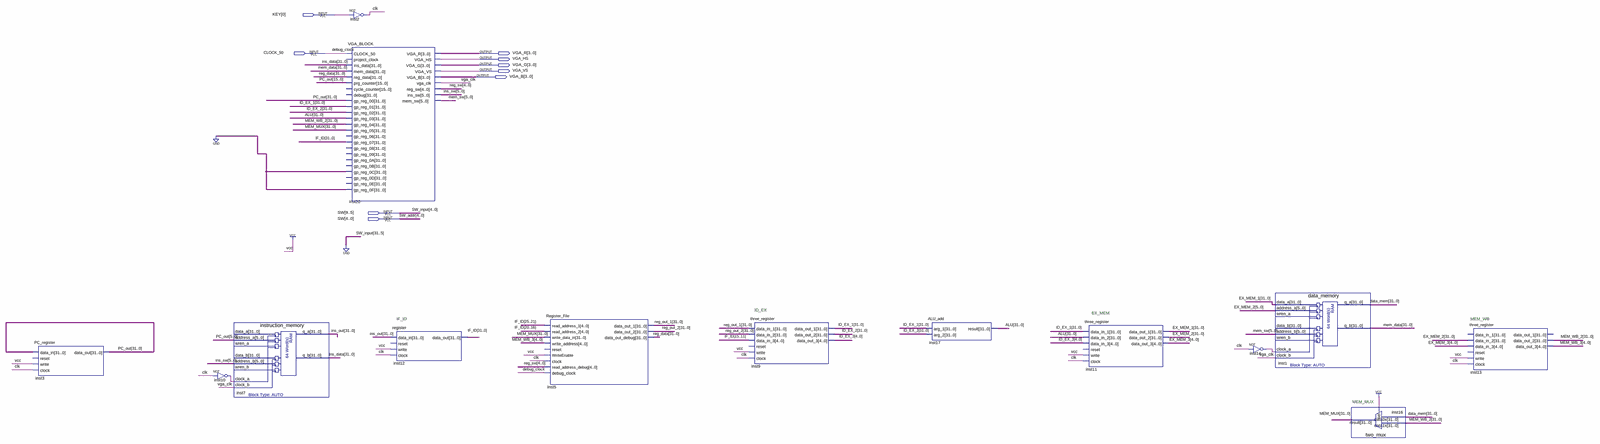
[diagram p0: schematic sheet, whole]
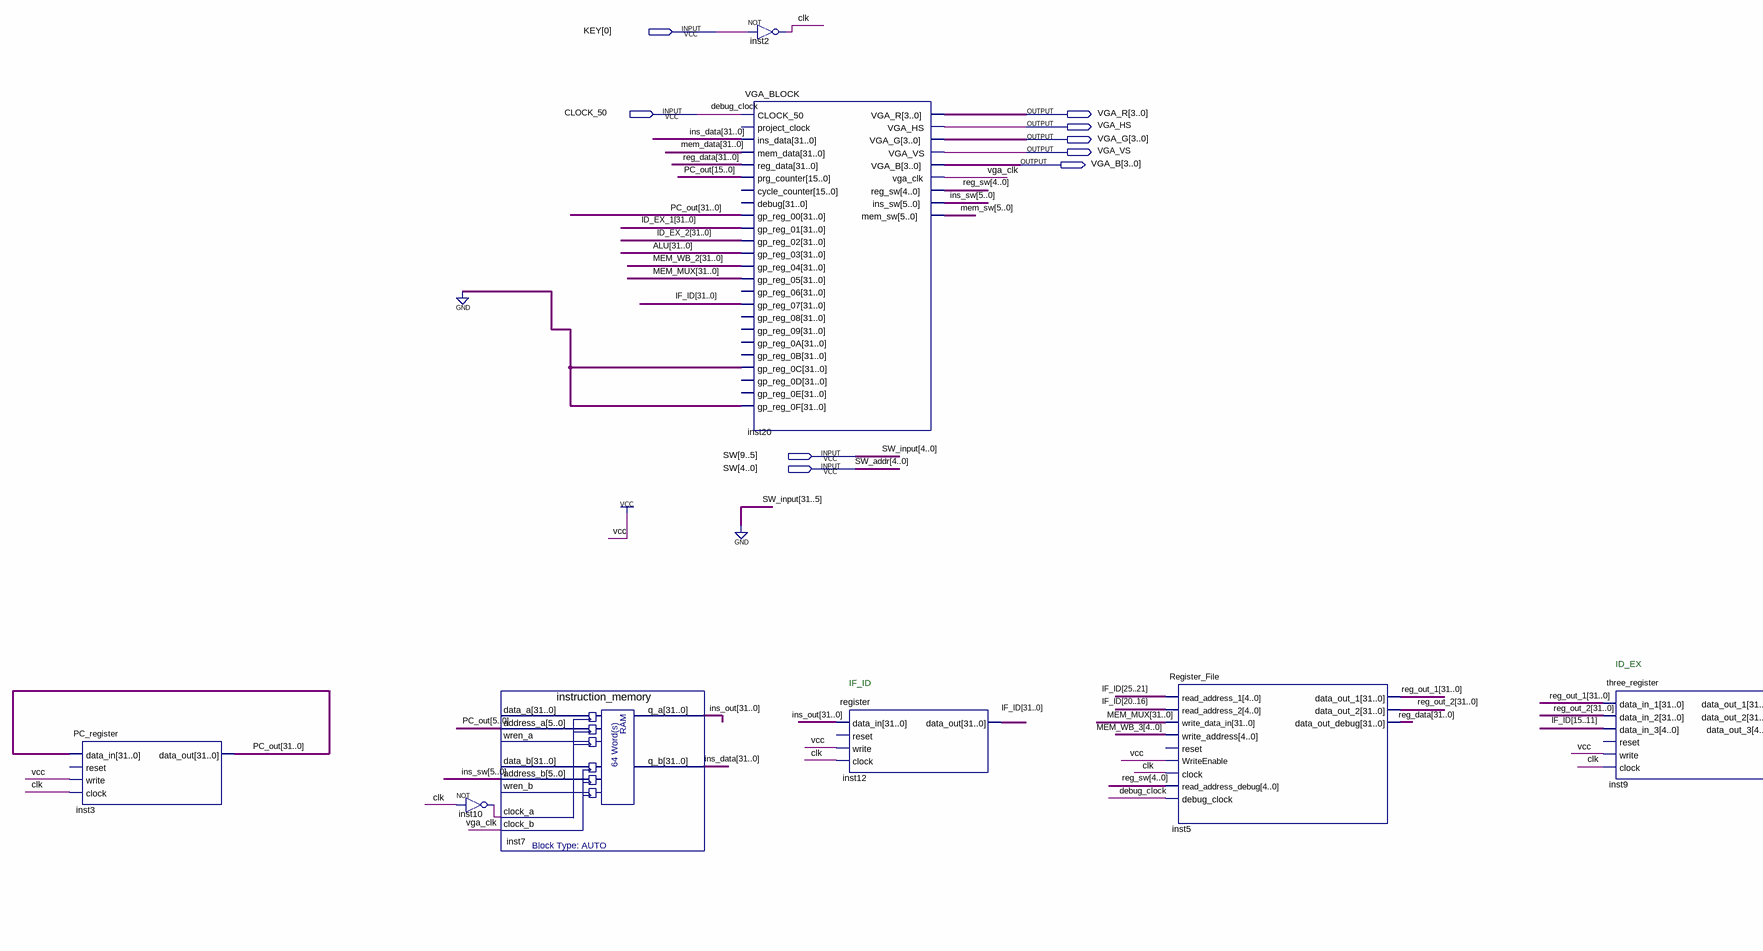
[diagram p1: schematic sheet, left part]
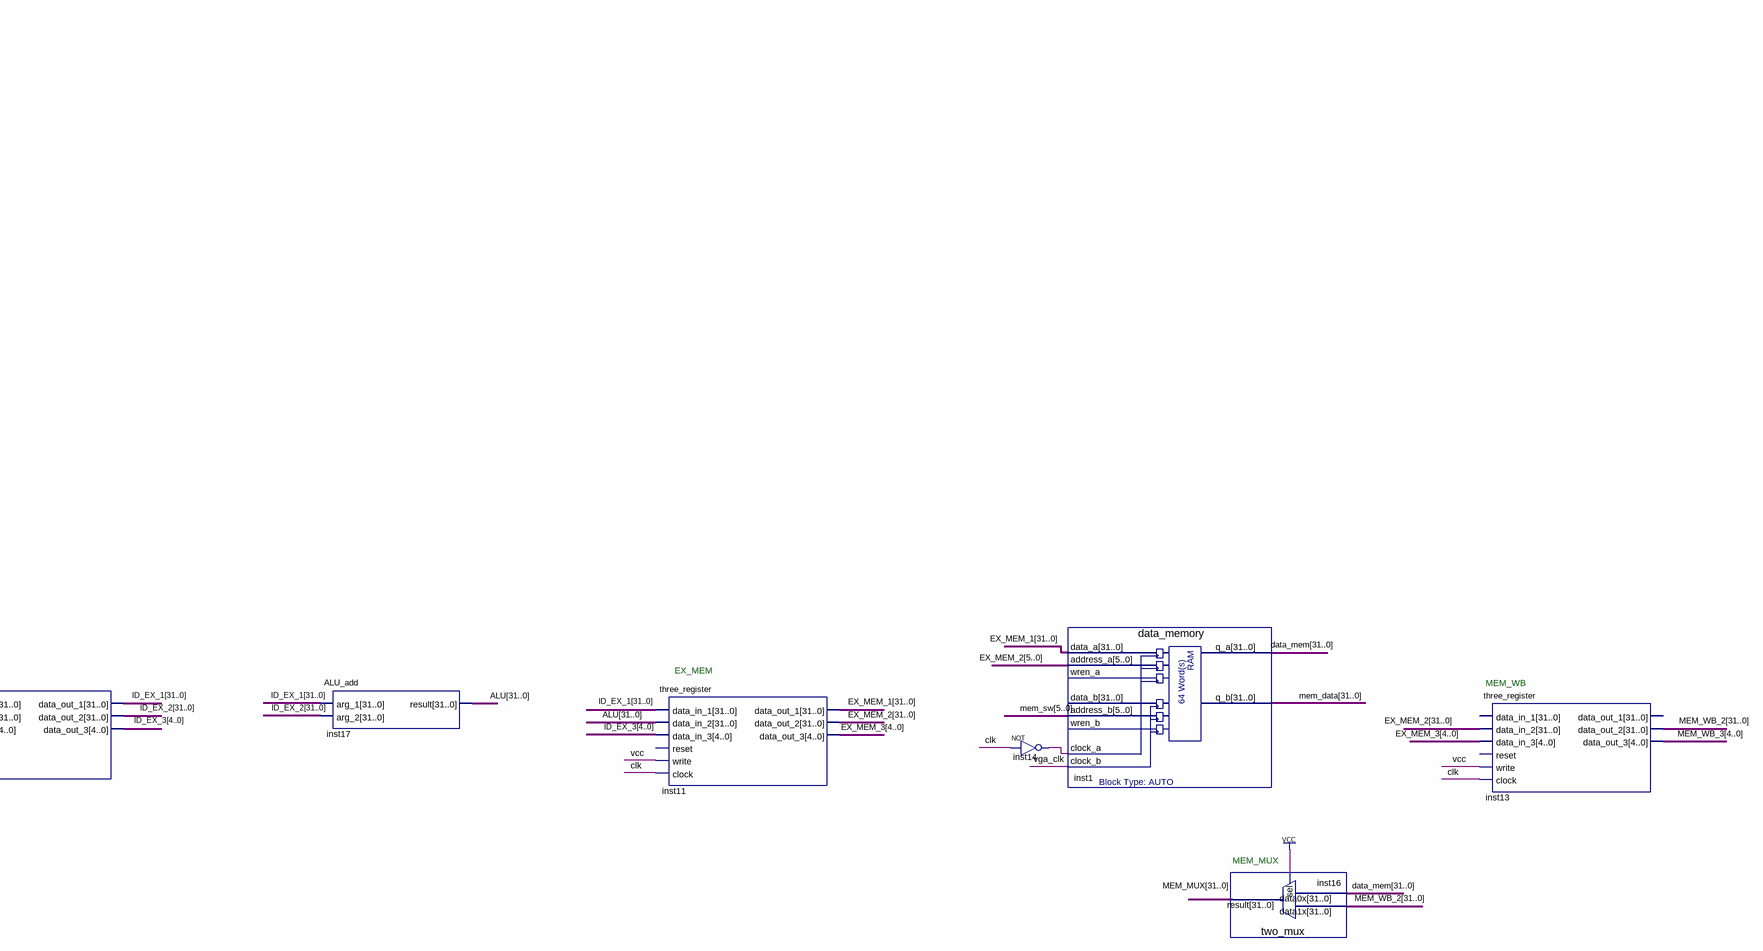
[diagram p2: schematic sheet, right part]
// Quartus schematic Register_File_and_Memory.bdf as structural Verilog: 14 symbols, 9 pins
module Register_File_and_Memory (
  input  [0:0] KEY,
  input  CLOCK_50,
  input  [9:0] SW,
  output [3:0] VGA_R,
  output VGA_HS,
  output [3:0] VGA_G,
  output VGA_VS,
  output [3:0] VGA_B
);

  wire clk, inst10_out, inst14_out, vga_clk;
  wire [4:0] EX_MEM_3, ID_EX_3, MEM_WB_3, reg_sw;
  wire [5:0] ins_sw, mem_sw;
  wire [31:0] ALU, data_mem, EX_MEM_1, EX_MEM_2, ID_EX_1, ID_EX_2, IF_ID, ins_data, ins_out, mem_data,
       MEM_MUX, MEM_WB_2, PC_out, reg_data, reg_out_1, reg_out_2;

  PC_register inst3 (.data_in(PC_out), .write(1'b1), .clock(clk), .data_out(PC_out));  // open: reset
  not inst10 (inst10_out, clk);
  instruction_memory inst7 (
    .address_a(PC_out[5:0]), .address_b(ins_sw), .clock_a(inst10_out), .clock_b(vga_clk), .q_a(ins_out),
    .q_b(ins_data));  // open: data_a, wren_a, data_b, wren_b
  not inst2 (clk, KEY[0]);
  VGA_BLOCK inst20 (
    .CLOCK_50(CLOCK_50), .ins_data(ins_data), .mem_data(mem_data), .reg_data(reg_data),
    .prg_counter(PC_out[15:0]), .gp_reg_00(PC_out), .gp_reg_01(ID_EX_1), .gp_reg_02(ID_EX_2),
    .gp_reg_03(ALU), .gp_reg_04(MEM_WB_2), .gp_reg_05(MEM_MUX), .gp_reg_07(IF_ID), .gp_reg_0C({32{1'b0}}),
    .gp_reg_0F({32{1'b0}}), .VGA_R(VGA_R), .VGA_HS(VGA_HS), .VGA_G(VGA_G), .VGA_VS(VGA_VS), .VGA_B(VGA_B),
    .vga_clk(vga_clk), .reg_sw(reg_sw), .ins_sw(ins_sw), .mem_sw(mem_sw));  // open: project_clock, cycle_counter, debug, gp_reg_06, gp_reg_08, gp_reg_09, gp_reg_0A, gp_reg_0B, gp_reg_0D, gp_reg_0E
  register inst12 (.data_in(ins_out), .write(1'b1), .clock(clk), .data_out(IF_ID));  // open: reset
  Register_File inst5 (
    .read_address_1(IF_ID[25:21]), .read_address_2(IF_ID[20:16]), .write_data_in(MEM_MUX),
    .write_address(MEM_WB_3), .WriteEnable(1'b1), .clock(clk), .read_address_debug(reg_sw),
    .debug_clock(CLOCK_50), .data_out_1(reg_out_1), .data_out_2(reg_out_2), .data_out_debug(reg_data));  // open: reset
  three_register inst9 (
    .data_in_1(reg_out_1), .data_in_2(reg_out_2), .data_in_3(IF_ID[15:11]), .write(1'b1), .clock(clk),
    .data_out_1(ID_EX_1), .data_out_2(ID_EX_2), .data_out_3(ID_EX_3));  // open: reset
  ALU_add inst17 (.arg_1(ID_EX_1), .arg_2(ID_EX_2), .result(ALU));
  three_register inst11 (
    .data_in_1(ID_EX_1), .data_in_2(ALU), .data_in_3(ID_EX_3), .write(1'b1), .clock(clk),
    .data_out_1(EX_MEM_1), .data_out_2(EX_MEM_2), .data_out_3(EX_MEM_3));  // open: reset
  not inst14 (inst14_out, clk);
  data_memory inst1 (
    .data_a(EX_MEM_1), .address_a(EX_MEM_2[5:0]), .address_b(mem_sw), .clock_a(inst14_out),
    .clock_b(vga_clk), .q_a(data_mem), .q_b(mem_data));  // open: wren_a, data_b, wren_b
  two_mux inst16 (.data1x(MEM_WB_2), .data0x(data_mem), .sel(1'b1), .result(MEM_MUX));
  three_register inst13 (
    .data_in_2(EX_MEM_2), .data_in_3(EX_MEM_3), .write(1'b1), .clock(clk), .data_out_2(MEM_WB_2),
    .data_out_3(MEM_WB_3));  // open: data_in_1, reset, data_out_1

  // Other names for the same wires on the sheet: debug_clock = CLOCK_50; SW_addr[4:0] = SW[4:0];
  //   SW_input[4:0] = SW[9:5]

  // Notes on the sheet:
  //   ID_EX
  //   EX_MEM
  //   IF_ID
  //   MEM_WB
  //   MEM_MUX
endmodule
